# Altium schematic sheet RF.SchDoc
size A4
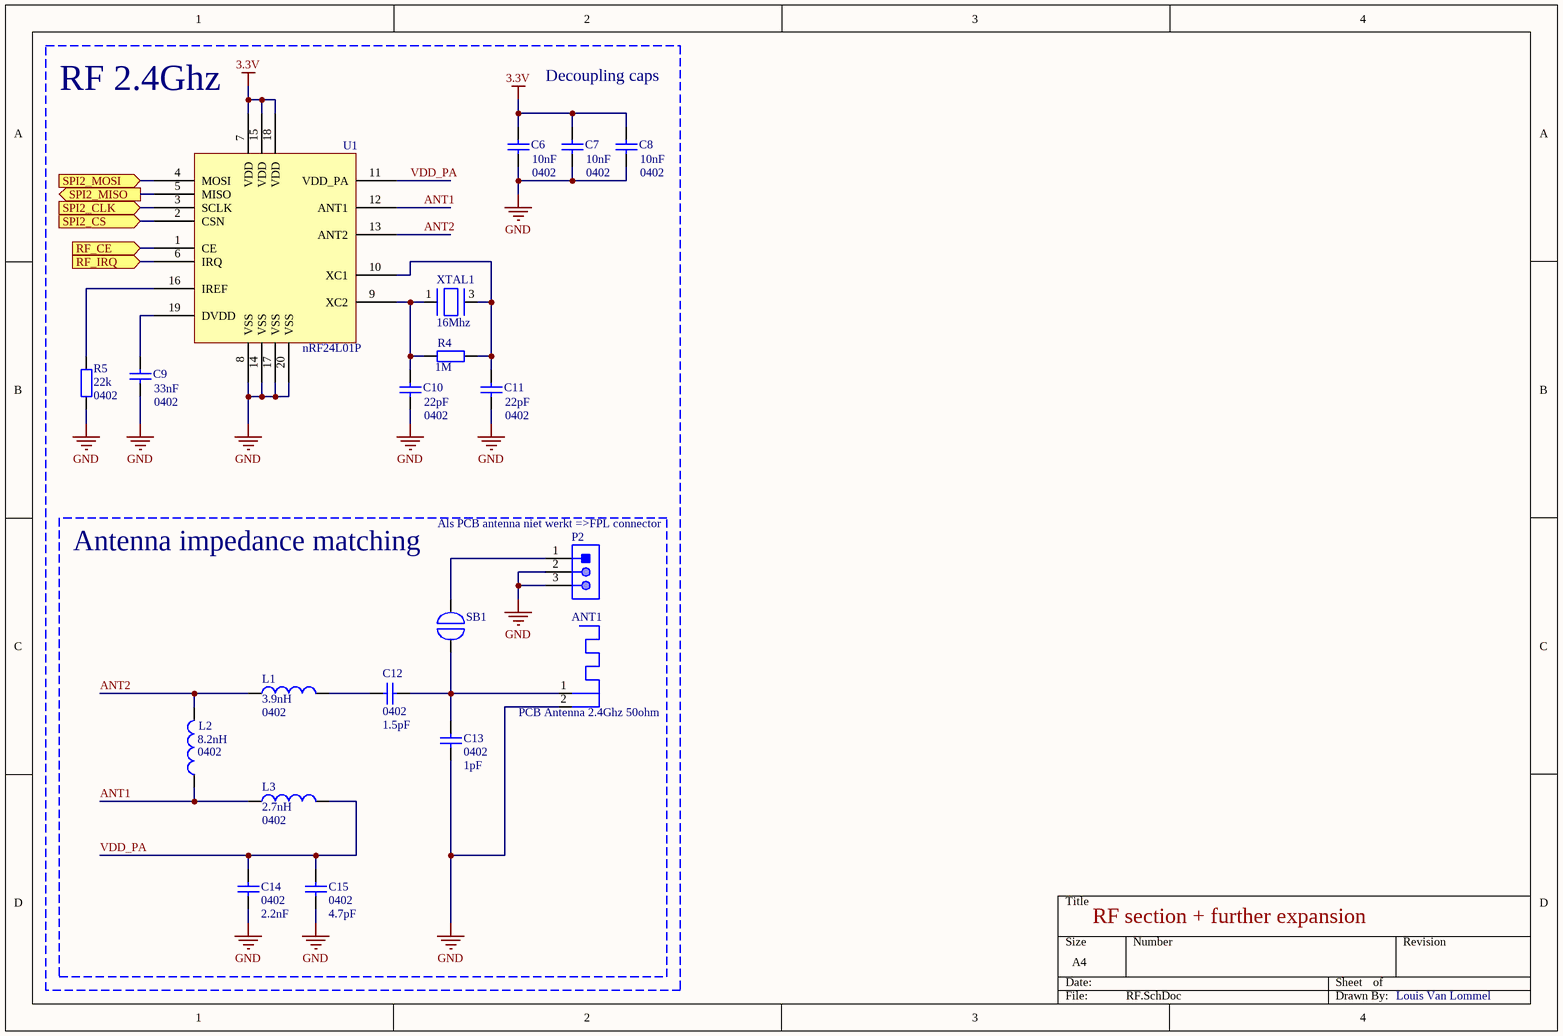
[diagram p0: RF.SchDoc]

## Parts
ANT1  PCB Antenna 2.4Ghz 50ohm  [2.4Ghz Antenna]
C6  0402  value 10nF  [CAP_0402]
C7  0402  value 10nF  [CAP_0402]
C8  0402  value 10nF  [CAP_0402]
C9  0402  value 33nF  [CAP_0402]
C10  0402  value 22pF  [CAP_0402]
C11  0402  value 22pF  [CAP_0402]
C12  0402  value 1.5pF  [CAP_0402]
C13  0402  value 1pF  [CAP_0402]
C14  0402  value 2.2nF  [CAP_0402]
C15  0402  value 4.7pF  [CAP_0402]
L1  0402  value 3.9nH  [IND_0402]
L2  0402  value 8.2nH  [IND_0402]
L3  0402  value 2.7nH  [IND_0402]
P2  (no value)  [HRS-U.FL-R-SMT-3_V]
R4  value 1M  [RES_0402]
R5  0402  value 22k  [RES_0603]
SB1  (no value)  [Solder bridge RF 0.254]
U1  nRF24L01P  [QFN20 4x4]
XTAL1  16Mhz  [16Mhz_Crystal]

## Blocks framed on the sheet
RF 2.4Ghz: C6-C11 R4 R5 U1 XTAL1
Antenna impedance matching: ANT1 C12-C15 L1-L3 P2 SB1

## Ports
RF_CE (in), RF_IRQ (in), SPI2_CLK (in), SPI2_CS (in), SPI2_MISO (out), SPI2_MOSI (in)

## Nets
3.3V: C6.2 C7.2 C8.2 U1.7(VDD) U1.15(VDD) U1.18(VDD)
GND: ANT1.2(GND) C6.1 C7.1 C8.1 C9.1 C10.1 C11.1 C13.2 C14.2 C15.2 P2.2 P2.3 R5.2 U1.8(VSS) U1.14(VSS) U1.17(VSS) U1.20(VSS)
ANT1: L2.1 L3.1 U1.12(ANT1)
ANT2: L1.1 L2.2 U1.13(ANT2)
RF_CE: U1.1(CE) ; port RF_CE
RF_IRQ: U1.6(IRQ) ; port RF_IRQ
SPI2_CLK: U1.3(SCLK) ; port SPI2_CLK
SPI2_CS: U1.2(CSN) ; port SPI2_CS
SPI2_MISO: U1.5(MISO) ; port SPI2_MISO
SPI2_MOSI: U1.4(MOSI) ; port SPI2_MOSI
VDD_PA: C14.1 C15.1 L3.2 U1.11(VDD_PA)
NetANT1_1: ANT1.1(RF) C12.1 C13.1 SB1.3
NetC9_2: C9.2 U1.19(DVDD)
NetC10_2: C10.2 R4.1 U1.9(XC2) XTAL1.1
NetC11_2: C11.2 R4.2 U1.10(XC1) XTAL1.3
NetC12_2: C12.2 L1.2
NetP2_1: P2.1 SB1.4
NetR5_1: R5.1 U1.16(IREF)

## Notes on the sheet
- Decoupling caps
- (near P2) Als PCB antenna niet werkt =>FPL connector
- RF section + further expansion
- Louis Van Lommel

## Library data of the parts
ANT1 = Antenna 2.4Ghz
C6-C15 = Cap: Capacitor; Published: 8-Jun-2000; LatestRevisionDate: 17-Jul-2002; LatestRevisionNote: Re-released for DXP Platform.; PackageReference: RAD-0.3; Publisher: Altium Limited; PackageDescription: Radial Cap, Thru-Hole; 2 Leads; 0.3 in Pin Spacing
L1-L3 = Inductor: Code_IEC: 1005; Published: 8-Jun-2000; LatestRevisionDate: 29-May-2009; LatestRevisionNote: IPC-7351 Footprint Added.; PackageReference: 0402-A; Publisher: Altium Limited; PackageDescription: Chip Inductor; Code_JEITA: 0402
P2 = CMP-2000-05153-1: Ultra Small Coaxial Connector, 6 GHz, -40 to 90 degC, 3-Pin SMD, RoHS, Bulk; Manufacturer: Hirose Electric; Connector Style: U.FL; Impedance: 50Ohm; Dielectric Material: LiquidCrystalPolymer(LCP); Minimum Quantity: UltraMiniatureCoaxial; Online Catalog: U.FLSeries; Featured Product: HiroseU.FLSeries; Frequency - Max: 6GHz; Other Names: H122041 / U.FL-R-SMT-1(01)-ND; Contact Termination: Solder; Body Material: PhosphorBronze; Connector Type: Jack,MalePin; Body Finish: Silver; Center Contact Plating: Gold; Manufacturer URL: https://www.hirose.com; Family: CoaxialConnectors(RF); Fastening Type: Snap-On; Unit PriceUSD: U.FL; Series: U.FL; Package Reference: U.FL-R-SMT; Packaging: Bulk; Standard Package: 100; Mounting Type: SurfaceMount; Quantity Available: Bulk; Housing Color: Silver; Package Description: 3-Pin Surface Mount Device, Body 2.6 x 2.6 mm; Category: Connectors,Interconnects; Operating Temperature: -40degC~90degC; Center Contact Material: PhosphorBronze; Dynamic Catalog: U.FLSeries; Datasheet URL: https://datasheet.ciiva.com/26945/getdatasheetpartid-475239-26945414.pdf; Datasheet Version: Feb-09; Shield Termination: Solder
R4 R5 = Res2: Resistor; Published: 8-Jun-2000; LatestRevisionDate: 17-Jul-2002; LatestRevisionNote: Re-released for DXP Platform.; PackageReference: AXIAL-0.4; Publisher: Altium Limited; PackageDescription: Axial Device, Thru-Hole; 2 Leads; 0.4 in Pin Spacing
SB1 = Solder bridge
U1 = nRF24L01P: Single Chip Transceiver, 2.4 GHz, 60 mW, 1.9 to 3.6 V, -40 to 85 degC, 20-Pin QFN, RoHS, Tray
XTAL1 = Crystal: Crystal, 16 MHz, SMD, 3.2mm x 2.5mm, 30 ppm, 18 pF, 30 ppm, 7M